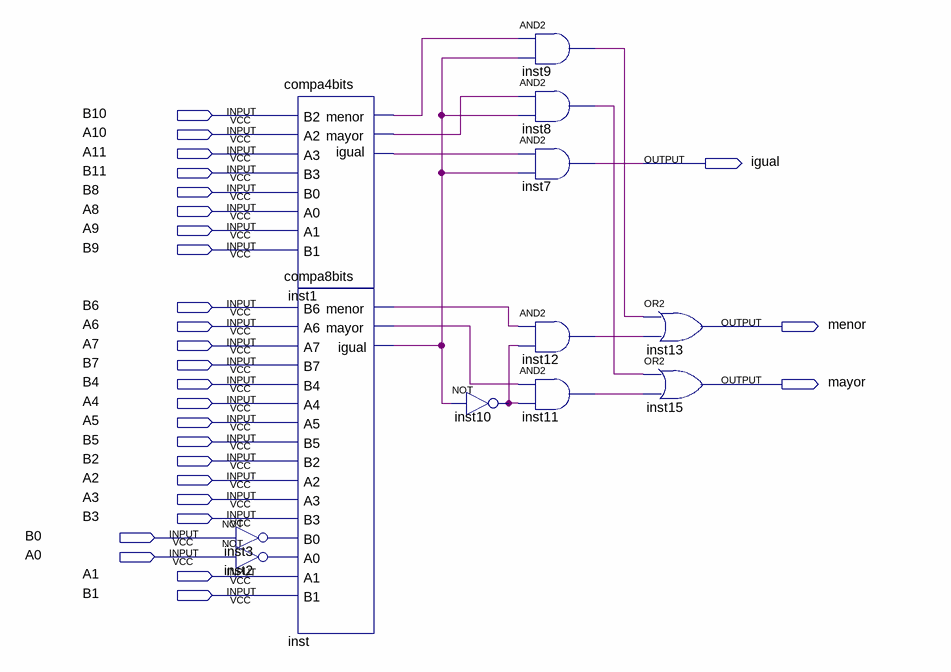
[diagram p0: schematic sheet]
// Quartus schematic comparador12.bdf as structural Verilog: 12 symbols, 27 pins
module comparador12 (
  input  B10,
  input  A10,
  input  A11,
  input  B11,
  input  B8,
  input  A8,
  input  A9,
  input  B9,
  input  B6,
  input  A6,
  input  A7,
  input  B7,
  input  B4,
  input  A4,
  input  A5,
  input  B5,
  input  B2,
  input  A2,
  input  A3,
  input  B3,
  input  B0,
  input  A0,
  input  A1,
  input  B1,
  output igual,
  output menor,
  output mayor
);

  wire inst1_igual, inst1_mayor, inst1_menor, inst2_out, inst3_out, inst8_out, inst9_out, inst10_out,
       inst11_out, inst12_out, inst_igual, inst_mayor, inst_menor;

  not inst3 (inst3_out, B0);
  not inst2 (inst2_out, A0);
  compa4bits inst1 (
    .B2(B10), .A2(A10), .A3(A11), .B3(B11), .B0(B8), .A0(A8), .A1(A9), .B1(B9), .igual(inst1_igual),
    .menor(inst1_menor), .mayor(inst1_mayor));
  compa8bits inst (
    .B6(B6), .A6(A6), .A7(A7), .B7(B7), .B4(B4), .A4(A4), .A5(A5), .B5(B5), .B2(B2), .A2(A2), .A3(A3),
    .B3(B3), .B0(inst3_out), .A0(inst2_out), .A1(A1), .B1(B1), .igual(inst_igual), .menor(inst_menor),
    .mayor(inst_mayor));
  not inst10 (inst10_out, inst_igual);
  and inst9 (inst9_out, inst1_menor, inst_igual);
  and inst8 (inst8_out, inst1_mayor, inst_igual);
  and inst7 (igual, inst1_igual, inst_igual);
  and inst12 (inst12_out, inst_menor, inst10_out);
  and inst11 (inst11_out, inst_mayor, inst10_out);
  or inst13 (menor, inst9_out, inst12_out);
  or inst15 (mayor, inst8_out, inst11_out);
endmodule
